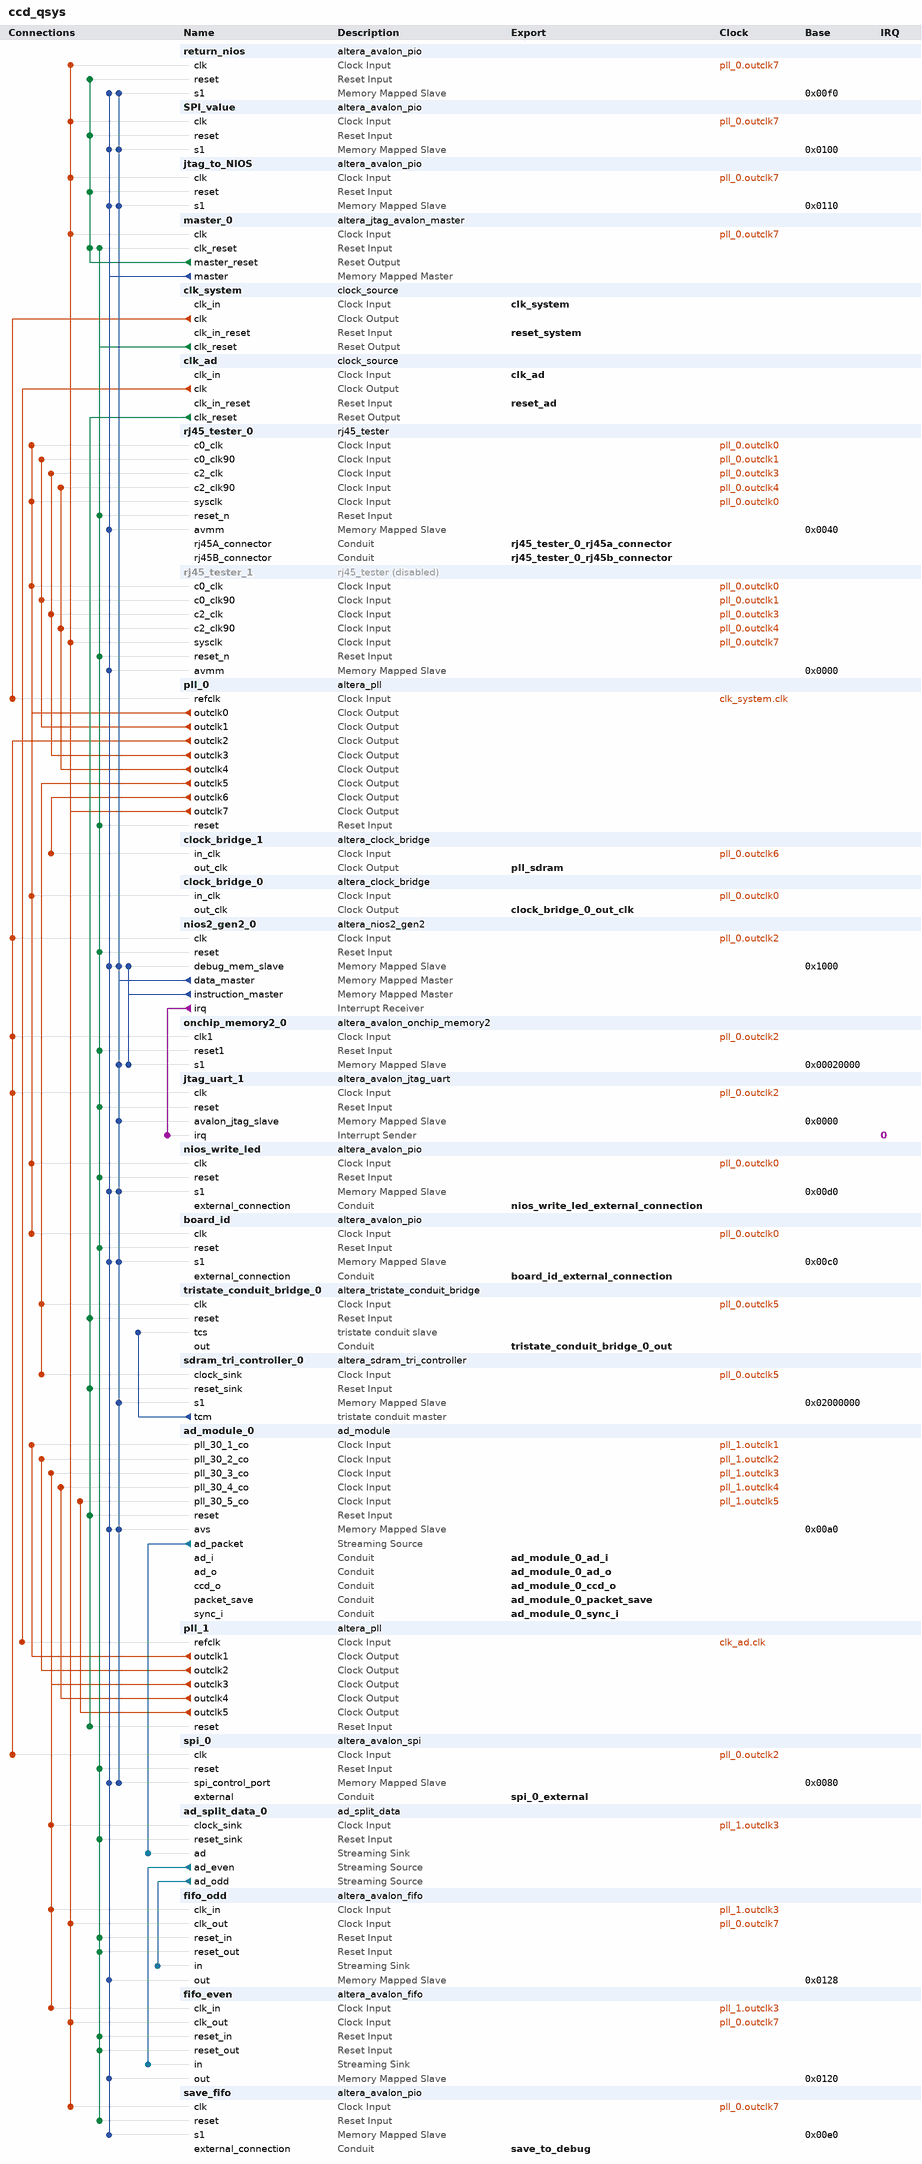
[diagram p0: system contents]
# Platform Designer (Qsys) system ccd_qsys, Cyclone V 5CEBA5F23C8
# Parameters at their usual value, and those the tool derives, are not listed.
package require -exact qsys 18.1
create_system ccd_qsys
set_project_property DEVICE_FAMILY {Cyclone V}
set_project_property DEVICE 5CEBA5F23C8

add_instance return_nios altera_avalon_pio 18.1
set_instance_parameter_value return_nios direction Bidir
set_instance_parameter_value return_nios width 8

add_instance SPI_value altera_avalon_pio 18.1
set_instance_parameter_value SPI_value direction Bidir
set_instance_parameter_value SPI_value width 8

add_instance jtag_to_NIOS altera_avalon_pio 18.1
set_instance_parameter_value jtag_to_NIOS direction Bidir
set_instance_parameter_value jtag_to_NIOS width 4

add_instance master_0 altera_jtag_avalon_master 18.1

add_instance clk_system clock_source 18.1
set_instance_parameter_value clk_system clockFrequency 40000000

add_instance clk_ad clock_source 18.1
set_instance_parameter_value clk_ad clockFrequency 40000000

add_instance rj45_tester_0 rj45_tester 1.0
set_instance_parameter_value rj45_tester_0 LINK_0_FREQUENCY_MHZ 50
set_instance_parameter_value rj45_tester_0 LINK_0_NUM_BYTES 256
set_instance_parameter_value rj45_tester_0 LINK_2_FREQUENCY_MHZ 20
set_instance_parameter_value rj45_tester_0 LINK_2_NUM_BYTES 128
set_instance_parameter_value rj45_tester_0 PERIOD_SYNC_US 100

add_instance rj45_tester_1 rj45_tester 1.0
set_instance_property rj45_tester_1 ENABLED false
set_instance_parameter_value rj45_tester_1 LINK_0_FREQUENCY_MHZ 50
set_instance_parameter_value rj45_tester_1 LINK_0_NUM_BYTES 500
set_instance_parameter_value rj45_tester_1 LINK_2_FREQUENCY_MHZ 20
set_instance_parameter_value rj45_tester_1 LINK_2_NUM_BYTES 80
set_instance_parameter_value rj45_tester_1 PERIOD_SYNC_US 100

add_instance pll_0 altera_pll 18.1
set_instance_parameter_value pll_0 gui_actual_output_clock_frequency3 {133.333333 MHz}
set_instance_parameter_value pll_0 gui_device_speed_grade 1
set_instance_parameter_value pll_0 gui_number_of_clocks 8
set_instance_parameter_value pll_0 gui_operation_mode direct
set_instance_parameter_value pll_0 gui_output_clock_frequency0 50.0
set_instance_parameter_value pll_0 gui_output_clock_frequency1 50.0
set_instance_parameter_value pll_0 gui_output_clock_frequency2 125.0
set_instance_parameter_value pll_0 gui_output_clock_frequency3 20.0
set_instance_parameter_value pll_0 gui_phase_shift_deg1 90.0
set_instance_parameter_value pll_0 gui_pll_mode {Integer-N PLL}
set_instance_parameter_value pll_0 gui_ps_units1 degrees
set_instance_parameter_value pll_0 gui_ps_units3 degrees
set_instance_parameter_value pll_0 gui_reference_clock_frequency 40.0
set_instance_parameter_value pll_0 gui_use_locked false

add_instance clock_bridge_1 altera_clock_bridge 18.1
set_instance_parameter_value clock_bridge_1 DERIVED_CLOCK_RATE 76923076
set_instance_parameter_value clock_bridge_1 EXPLICIT_CLOCK_RATE 0

add_instance clock_bridge_0 altera_clock_bridge 18.1
set_instance_parameter_value clock_bridge_0 DERIVED_CLOCK_RATE 50000000
set_instance_parameter_value clock_bridge_0 EXPLICIT_CLOCK_RATE 0

add_instance nios2_gen2_0 altera_nios2_gen2 18.1
set_instance_parameter_value nios2_gen2_0 dcache_size 2048
set_instance_parameter_value nios2_gen2_0 exceptionSlave onchip_memory2_0.s1
set_instance_parameter_value nios2_gen2_0 icache_size 4096
set_instance_parameter_value nios2_gen2_0 impl Tiny
set_instance_parameter_value nios2_gen2_0 resetSlave onchip_memory2_0.s1

add_instance onchip_memory2_0 altera_avalon_onchip_memory2 18.1
set_instance_parameter_value onchip_memory2_0 dataWidth 32
set_instance_parameter_value onchip_memory2_0 dualPort false
set_instance_parameter_value onchip_memory2_0 initMemContent true
set_instance_parameter_value onchip_memory2_0 initializationFileName onchip_mem.hex
set_instance_parameter_value onchip_memory2_0 memorySize 40960

add_instance jtag_uart_1 altera_avalon_jtag_uart 18.1
set_instance_parameter_value jtag_uart_1 simInteractiveOptions NO_INTERACTIVE_WINDOWS

add_instance nios_write_led altera_avalon_pio 18.1
set_instance_parameter_value nios_write_led direction Output
set_instance_parameter_value nios_write_led width 4

add_instance board_id altera_avalon_pio 18.1
set_instance_parameter_value board_id direction Input
set_instance_parameter_value board_id width 8

add_instance tristate_conduit_bridge_0 altera_tristate_conduit_bridge 18.1

add_instance sdram_tri_controller_0 altera_sdram_tri_controller 18.1
set_instance_parameter_value sdram_tri_controller_0 CAS_LATENCY 3
set_instance_parameter_value sdram_tri_controller_0 INIT_REFRESH 2
set_instance_parameter_value sdram_tri_controller_0 NUM_CHIPSELECTS 1
set_instance_parameter_value sdram_tri_controller_0 SDRAM_COL_WIDTH 9
set_instance_parameter_value sdram_tri_controller_0 SDRAM_DATA_WIDTH 16
set_instance_parameter_value sdram_tri_controller_0 SDRAM_ROW_WIDTH 13
set_instance_parameter_value sdram_tri_controller_0 TAC 5.5
set_instance_parameter_value sdram_tri_controller_0 TRCD 60.0
set_instance_parameter_value sdram_tri_controller_0 TRFC 70.0
set_instance_parameter_value sdram_tri_controller_0 TRISTATE_EN true
set_instance_parameter_value sdram_tri_controller_0 TRP 20.0
set_instance_parameter_value sdram_tri_controller_0 TWR 15.0
set_instance_parameter_value sdram_tri_controller_0 generateSimulationModel false
set_instance_parameter_value sdram_tri_controller_0 model single_Micron_MT48LC4M32B2_7_chip
set_instance_parameter_value sdram_tri_controller_0 numberOfBanks 4
set_instance_parameter_value sdram_tri_controller_0 powerUpDelay 100.0
set_instance_parameter_value sdram_tri_controller_0 refreshPeriod 15.625

add_instance ad_module_0 ad_module 1.0

add_instance pll_1 altera_pll 18.1
set_instance_parameter_value pll_1 gui_device_speed_grade 1
set_instance_parameter_value pll_1 gui_duty_cycle2 25
set_instance_parameter_value pll_1 gui_number_of_clocks 7
set_instance_parameter_value pll_1 gui_operation_mode direct
set_instance_parameter_value pll_1 gui_output_clock_frequency0 50.0
set_instance_parameter_value pll_1 gui_output_clock_frequency1 30.0
set_instance_parameter_value pll_1 gui_output_clock_frequency2 30.0
set_instance_parameter_value pll_1 gui_output_clock_frequency3 30.0
set_instance_parameter_value pll_1 gui_phase_shift_deg3 213.7
set_instance_parameter_value pll_1 gui_pll_mode {Integer-N PLL}
set_instance_parameter_value pll_1 gui_ps_units2 degrees
set_instance_parameter_value pll_1 gui_ps_units3 degrees
set_instance_parameter_value pll_1 gui_reference_clock_frequency 40.0
set_instance_parameter_value pll_1 gui_use_locked false

add_instance spi_0 altera_avalon_spi 18.1
set_instance_parameter_value spi_0 clockPolarity 0
set_instance_parameter_value spi_0 dataWidth 16
set_instance_parameter_value spi_0 lsbOrderedFirst true
set_instance_parameter_value spi_0 masterSPI true
set_instance_parameter_value spi_0 numberOfSlaves 6
set_instance_parameter_value spi_0 targetClockRate 1000000

add_instance ad_split_data_0 ad_split_data 1.0

add_instance fifo_odd altera_avalon_fifo 18.1
set_instance_parameter_value fifo_odd bitsPerSymbol 32
set_instance_parameter_value fifo_odd channelWidth 0
set_instance_parameter_value fifo_odd errorWidth 0
set_instance_parameter_value fifo_odd fifoDepth 2048
set_instance_parameter_value fifo_odd fifoInputInterfaceOptions AVALONST_SINK
set_instance_parameter_value fifo_odd fifoOutputInterfaceOptions AVALONMM_READ
set_instance_parameter_value fifo_odd singleClockMode false
set_instance_parameter_value fifo_odd symbolsPerBeat 1
set_instance_parameter_value fifo_odd useBackpressure false
set_instance_parameter_value fifo_odd useIRQ false
set_instance_parameter_value fifo_odd usePacket false
set_instance_parameter_value fifo_odd useReadControl false
set_instance_parameter_value fifo_odd useWriteControl false

add_instance fifo_even altera_avalon_fifo 18.1
set_instance_parameter_value fifo_even bitsPerSymbol 32
set_instance_parameter_value fifo_even channelWidth 0
set_instance_parameter_value fifo_even errorWidth 0
set_instance_parameter_value fifo_even fifoDepth 2048
set_instance_parameter_value fifo_even fifoInputInterfaceOptions AVALONST_SINK
set_instance_parameter_value fifo_even fifoOutputInterfaceOptions AVALONMM_READ
set_instance_parameter_value fifo_even singleClockMode false
set_instance_parameter_value fifo_even symbolsPerBeat 1
set_instance_parameter_value fifo_even useBackpressure false
set_instance_parameter_value fifo_even useIRQ false
set_instance_parameter_value fifo_even usePacket false
set_instance_parameter_value fifo_even useReadControl false
set_instance_parameter_value fifo_even useWriteControl false

add_instance save_fifo altera_avalon_pio 18.1
set_instance_parameter_value save_fifo direction Output
set_instance_parameter_value save_fifo width 8

# connections
add_connection clk_ad.clk pll_1.refclk clock
add_connection clk_system.clk pll_0.refclk clock
add_connection pll_0.outclk0 board_id.clk clock
add_connection pll_0.outclk0 clock_bridge_0.in_clk clock
add_connection pll_0.outclk0 nios_write_led.clk clock
add_connection pll_0.outclk0 rj45_tester_0.c0_clk clock
add_connection pll_0.outclk0 rj45_tester_0.sysclk clock
add_connection pll_0.outclk0 rj45_tester_1.c0_clk clock
add_connection pll_0.outclk1 rj45_tester_0.c0_clk90 clock
add_connection pll_0.outclk1 rj45_tester_1.c0_clk90 clock
add_connection pll_0.outclk2 jtag_uart_1.clk clock
add_connection pll_0.outclk2 nios2_gen2_0.clk clock
add_connection pll_0.outclk2 onchip_memory2_0.clk1 clock
add_connection pll_0.outclk2 spi_0.clk clock
add_connection pll_0.outclk3 rj45_tester_0.c2_clk clock
add_connection pll_0.outclk3 rj45_tester_1.c2_clk clock
add_connection pll_0.outclk4 rj45_tester_0.c2_clk90 clock
add_connection pll_0.outclk4 rj45_tester_1.c2_clk90 clock
add_connection pll_0.outclk5 sdram_tri_controller_0.clock_sink clock
add_connection pll_0.outclk5 tristate_conduit_bridge_0.clk clock
add_connection pll_0.outclk6 clock_bridge_1.in_clk clock
add_connection pll_0.outclk7 fifo_even.clk_out clock
add_connection pll_0.outclk7 fifo_odd.clk_out clock
add_connection pll_0.outclk7 jtag_to_NIOS.clk clock
add_connection pll_0.outclk7 master_0.clk clock
add_connection pll_0.outclk7 return_nios.clk clock
add_connection pll_0.outclk7 rj45_tester_1.sysclk clock
add_connection pll_0.outclk7 save_fifo.clk clock
add_connection pll_0.outclk7 SPI_value.clk clock
add_connection pll_1.outclk1 ad_module_0.pll_30_1_co clock
add_connection pll_1.outclk2 ad_module_0.pll_30_2_co clock
add_connection pll_1.outclk3 ad_module_0.pll_30_3_co clock
add_connection pll_1.outclk3 ad_split_data_0.clock_sink clock
add_connection pll_1.outclk3 fifo_even.clk_in clock
add_connection pll_1.outclk3 fifo_odd.clk_in clock
add_connection pll_1.outclk4 ad_module_0.pll_30_4_co clock
add_connection pll_1.outclk5 ad_module_0.pll_30_5_co clock
add_connection clk_ad.clk_reset ad_module_0.reset reset
add_connection clk_ad.clk_reset pll_1.reset reset
add_connection clk_ad.clk_reset sdram_tri_controller_0.reset_sink reset
add_connection clk_ad.clk_reset tristate_conduit_bridge_0.reset reset
add_connection clk_system.clk_reset ad_split_data_0.reset_sink reset
add_connection clk_system.clk_reset board_id.reset reset
add_connection clk_system.clk_reset fifo_even.reset_in reset
add_connection clk_system.clk_reset fifo_even.reset_out reset
add_connection clk_system.clk_reset fifo_odd.reset_in reset
add_connection clk_system.clk_reset fifo_odd.reset_out reset
add_connection clk_system.clk_reset jtag_uart_1.reset reset
add_connection clk_system.clk_reset master_0.clk_reset reset
add_connection clk_system.clk_reset nios2_gen2_0.reset reset
add_connection clk_system.clk_reset nios_write_led.reset reset
add_connection clk_system.clk_reset onchip_memory2_0.reset1 reset
add_connection clk_system.clk_reset pll_0.reset reset
add_connection clk_system.clk_reset rj45_tester_0.reset_n reset
add_connection clk_system.clk_reset rj45_tester_1.reset_n reset
add_connection clk_system.clk_reset save_fifo.reset reset
add_connection clk_system.clk_reset spi_0.reset reset
add_connection master_0.master_reset jtag_to_NIOS.reset reset
add_connection master_0.master_reset master_0.clk_reset reset
add_connection master_0.master_reset return_nios.reset reset
add_connection master_0.master_reset SPI_value.reset reset
add_connection master_0.master ad_module_0.avs avalon
set_connection_parameter_value master_0.master/ad_module_0.avs baseAddress 0x00a0
add_connection master_0.master board_id.s1 avalon
set_connection_parameter_value master_0.master/board_id.s1 baseAddress 0x00c0
add_connection master_0.master fifo_even.out avalon
set_connection_parameter_value master_0.master/fifo_even.out baseAddress 0x0120
add_connection master_0.master fifo_odd.out avalon
set_connection_parameter_value master_0.master/fifo_odd.out baseAddress 0x0128
add_connection master_0.master jtag_to_NIOS.s1 avalon
set_connection_parameter_value master_0.master/jtag_to_NIOS.s1 baseAddress 0x0110
add_connection master_0.master nios2_gen2_0.debug_mem_slave avalon
set_connection_parameter_value master_0.master/nios2_gen2_0.debug_mem_slave baseAddress 0x1000
add_connection master_0.master nios_write_led.s1 avalon
set_connection_parameter_value master_0.master/nios_write_led.s1 baseAddress 0x00d0
add_connection master_0.master return_nios.s1 avalon
set_connection_parameter_value master_0.master/return_nios.s1 baseAddress 0x00f0
add_connection master_0.master rj45_tester_0.avmm avalon
set_connection_parameter_value master_0.master/rj45_tester_0.avmm baseAddress 0x0040
add_connection master_0.master rj45_tester_1.avmm avalon
set_connection_parameter_value master_0.master/rj45_tester_1.avmm baseAddress 0x0000
add_connection master_0.master save_fifo.s1 avalon
set_connection_parameter_value master_0.master/save_fifo.s1 baseAddress 0x00e0
add_connection master_0.master spi_0.spi_control_port avalon
set_connection_parameter_value master_0.master/spi_0.spi_control_port baseAddress 0x0080
add_connection master_0.master SPI_value.s1 avalon
set_connection_parameter_value master_0.master/SPI_value.s1 baseAddress 0x0100
add_connection nios2_gen2_0.data_master ad_module_0.avs avalon
set_connection_parameter_value nios2_gen2_0.data_master/ad_module_0.avs baseAddress 0x00a0
add_connection nios2_gen2_0.data_master board_id.s1 avalon
set_connection_parameter_value nios2_gen2_0.data_master/board_id.s1 baseAddress 0x00c0
add_connection nios2_gen2_0.data_master jtag_to_NIOS.s1 avalon
set_connection_parameter_value nios2_gen2_0.data_master/jtag_to_NIOS.s1 baseAddress 0x0110
add_connection nios2_gen2_0.data_master jtag_uart_1.avalon_jtag_slave avalon
set_connection_parameter_value nios2_gen2_0.data_master/jtag_uart_1.avalon_jtag_slave baseAddress 0x0000
add_connection nios2_gen2_0.data_master nios2_gen2_0.debug_mem_slave avalon
set_connection_parameter_value nios2_gen2_0.data_master/nios2_gen2_0.debug_mem_slave baseAddress 0x1000
add_connection nios2_gen2_0.data_master nios_write_led.s1 avalon
set_connection_parameter_value nios2_gen2_0.data_master/nios_write_led.s1 baseAddress 0x00d0
add_connection nios2_gen2_0.data_master onchip_memory2_0.s1 avalon
set_connection_parameter_value nios2_gen2_0.data_master/onchip_memory2_0.s1 baseAddress 0x00020000
add_connection nios2_gen2_0.data_master return_nios.s1 avalon
set_connection_parameter_value nios2_gen2_0.data_master/return_nios.s1 baseAddress 0x00f0
add_connection nios2_gen2_0.data_master sdram_tri_controller_0.s1 avalon
set_connection_parameter_value nios2_gen2_0.data_master/sdram_tri_controller_0.s1 baseAddress 0x02000000
add_connection nios2_gen2_0.data_master spi_0.spi_control_port avalon
set_connection_parameter_value nios2_gen2_0.data_master/spi_0.spi_control_port baseAddress 0x0080
add_connection nios2_gen2_0.data_master SPI_value.s1 avalon
set_connection_parameter_value nios2_gen2_0.data_master/SPI_value.s1 baseAddress 0x0100
add_connection nios2_gen2_0.instruction_master nios2_gen2_0.debug_mem_slave avalon
set_connection_parameter_value nios2_gen2_0.instruction_master/nios2_gen2_0.debug_mem_slave baseAddress 0x1000
add_connection nios2_gen2_0.instruction_master onchip_memory2_0.s1 avalon
set_connection_parameter_value nios2_gen2_0.instruction_master/onchip_memory2_0.s1 baseAddress 0x00020000
add_connection ad_module_0.ad_packet ad_split_data_0.ad avalon_streaming
add_connection ad_split_data_0.ad_even fifo_even.in avalon_streaming
add_connection ad_split_data_0.ad_odd fifo_odd.in avalon_streaming
add_connection nios2_gen2_0.irq jtag_uart_1.irq interrupt
set_connection_parameter_value nios2_gen2_0.irq/jtag_uart_1.irq irqNumber 0
add_connection sdram_tri_controller_0.tcm tristate_conduit_bridge_0.tcs tristate_conduit

# exported interfaces
add_interface ad_module_0_ad_i conduit end
set_interface_property ad_module_0_ad_i EXPORT_OF ad_module_0.ad_i
add_interface ad_module_0_ad_o conduit end
set_interface_property ad_module_0_ad_o EXPORT_OF ad_module_0.ad_o
add_interface ad_module_0_ccd_o conduit end
set_interface_property ad_module_0_ccd_o EXPORT_OF ad_module_0.ccd_o
add_interface ad_module_0_packet_save conduit end
set_interface_property ad_module_0_packet_save EXPORT_OF ad_module_0.packet_save
add_interface ad_module_0_sync_i conduit end
set_interface_property ad_module_0_sync_i EXPORT_OF ad_module_0.sync_i
add_interface board_id_external_connection conduit end
set_interface_property board_id_external_connection EXPORT_OF board_id.external_connection
add_interface clk_ad clock sink
set_interface_property clk_ad EXPORT_OF clk_ad.clk_in
add_interface clk_system clock sink
set_interface_property clk_system EXPORT_OF clk_system.clk_in
add_interface clock_bridge_0_out_clk clock source
set_interface_property clock_bridge_0_out_clk EXPORT_OF clock_bridge_0.out_clk
add_interface nios_write_led_external_connection conduit end
set_interface_property nios_write_led_external_connection EXPORT_OF nios_write_led.external_connection
add_interface pll_sdram clock source
set_interface_property pll_sdram EXPORT_OF clock_bridge_1.out_clk
add_interface reset_ad reset sink
set_interface_property reset_ad EXPORT_OF clk_ad.clk_in_reset
add_interface reset_system reset sink
set_interface_property reset_system EXPORT_OF clk_system.clk_in_reset
add_interface rj45_tester_0_rj45a_connector conduit end
set_interface_property rj45_tester_0_rj45a_connector EXPORT_OF rj45_tester_0.rj45A_connector
add_interface rj45_tester_0_rj45b_connector conduit end
set_interface_property rj45_tester_0_rj45b_connector EXPORT_OF rj45_tester_0.rj45B_connector
add_interface save_to_debug conduit end
set_interface_property save_to_debug EXPORT_OF save_fifo.external_connection
add_interface spi_0_external conduit end
set_interface_property spi_0_external EXPORT_OF spi_0.external
add_interface tristate_conduit_bridge_0_out conduit end
set_interface_property tristate_conduit_bridge_0_out EXPORT_OF tristate_conduit_bridge_0.out

set_interconnect_requirement {$system} qsys_mm.clockCrossingAdapter HANDSHAKE
set_interconnect_requirement {$system} qsys_mm.enableEccProtection FALSE
set_interconnect_requirement {$system} qsys_mm.insertDefaultSlave FALSE
set_interconnect_requirement {$system} qsys_mm.maxAdditionalLatency 1

save_system ccd_qsys.qsys
